# EAGLE design pebble (EAGLE 5.10)
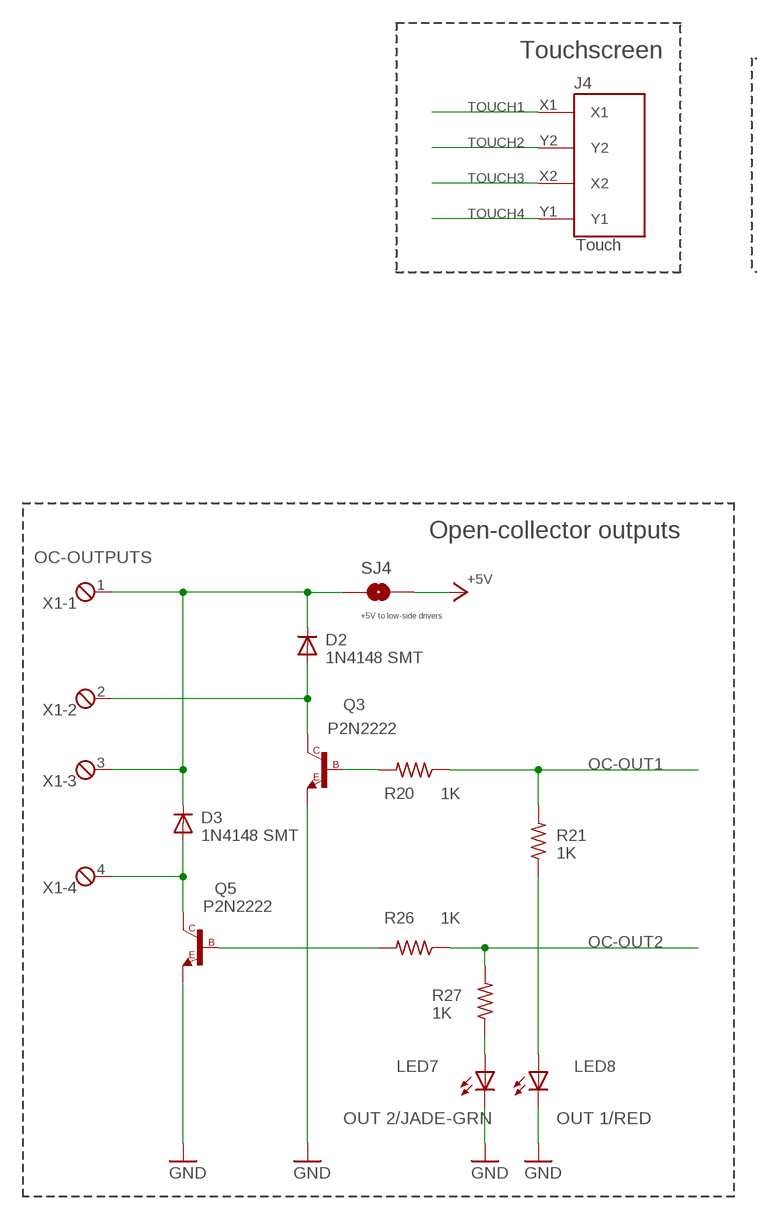
[diagram p0: schematic, sheet 1, part 1 of 2]
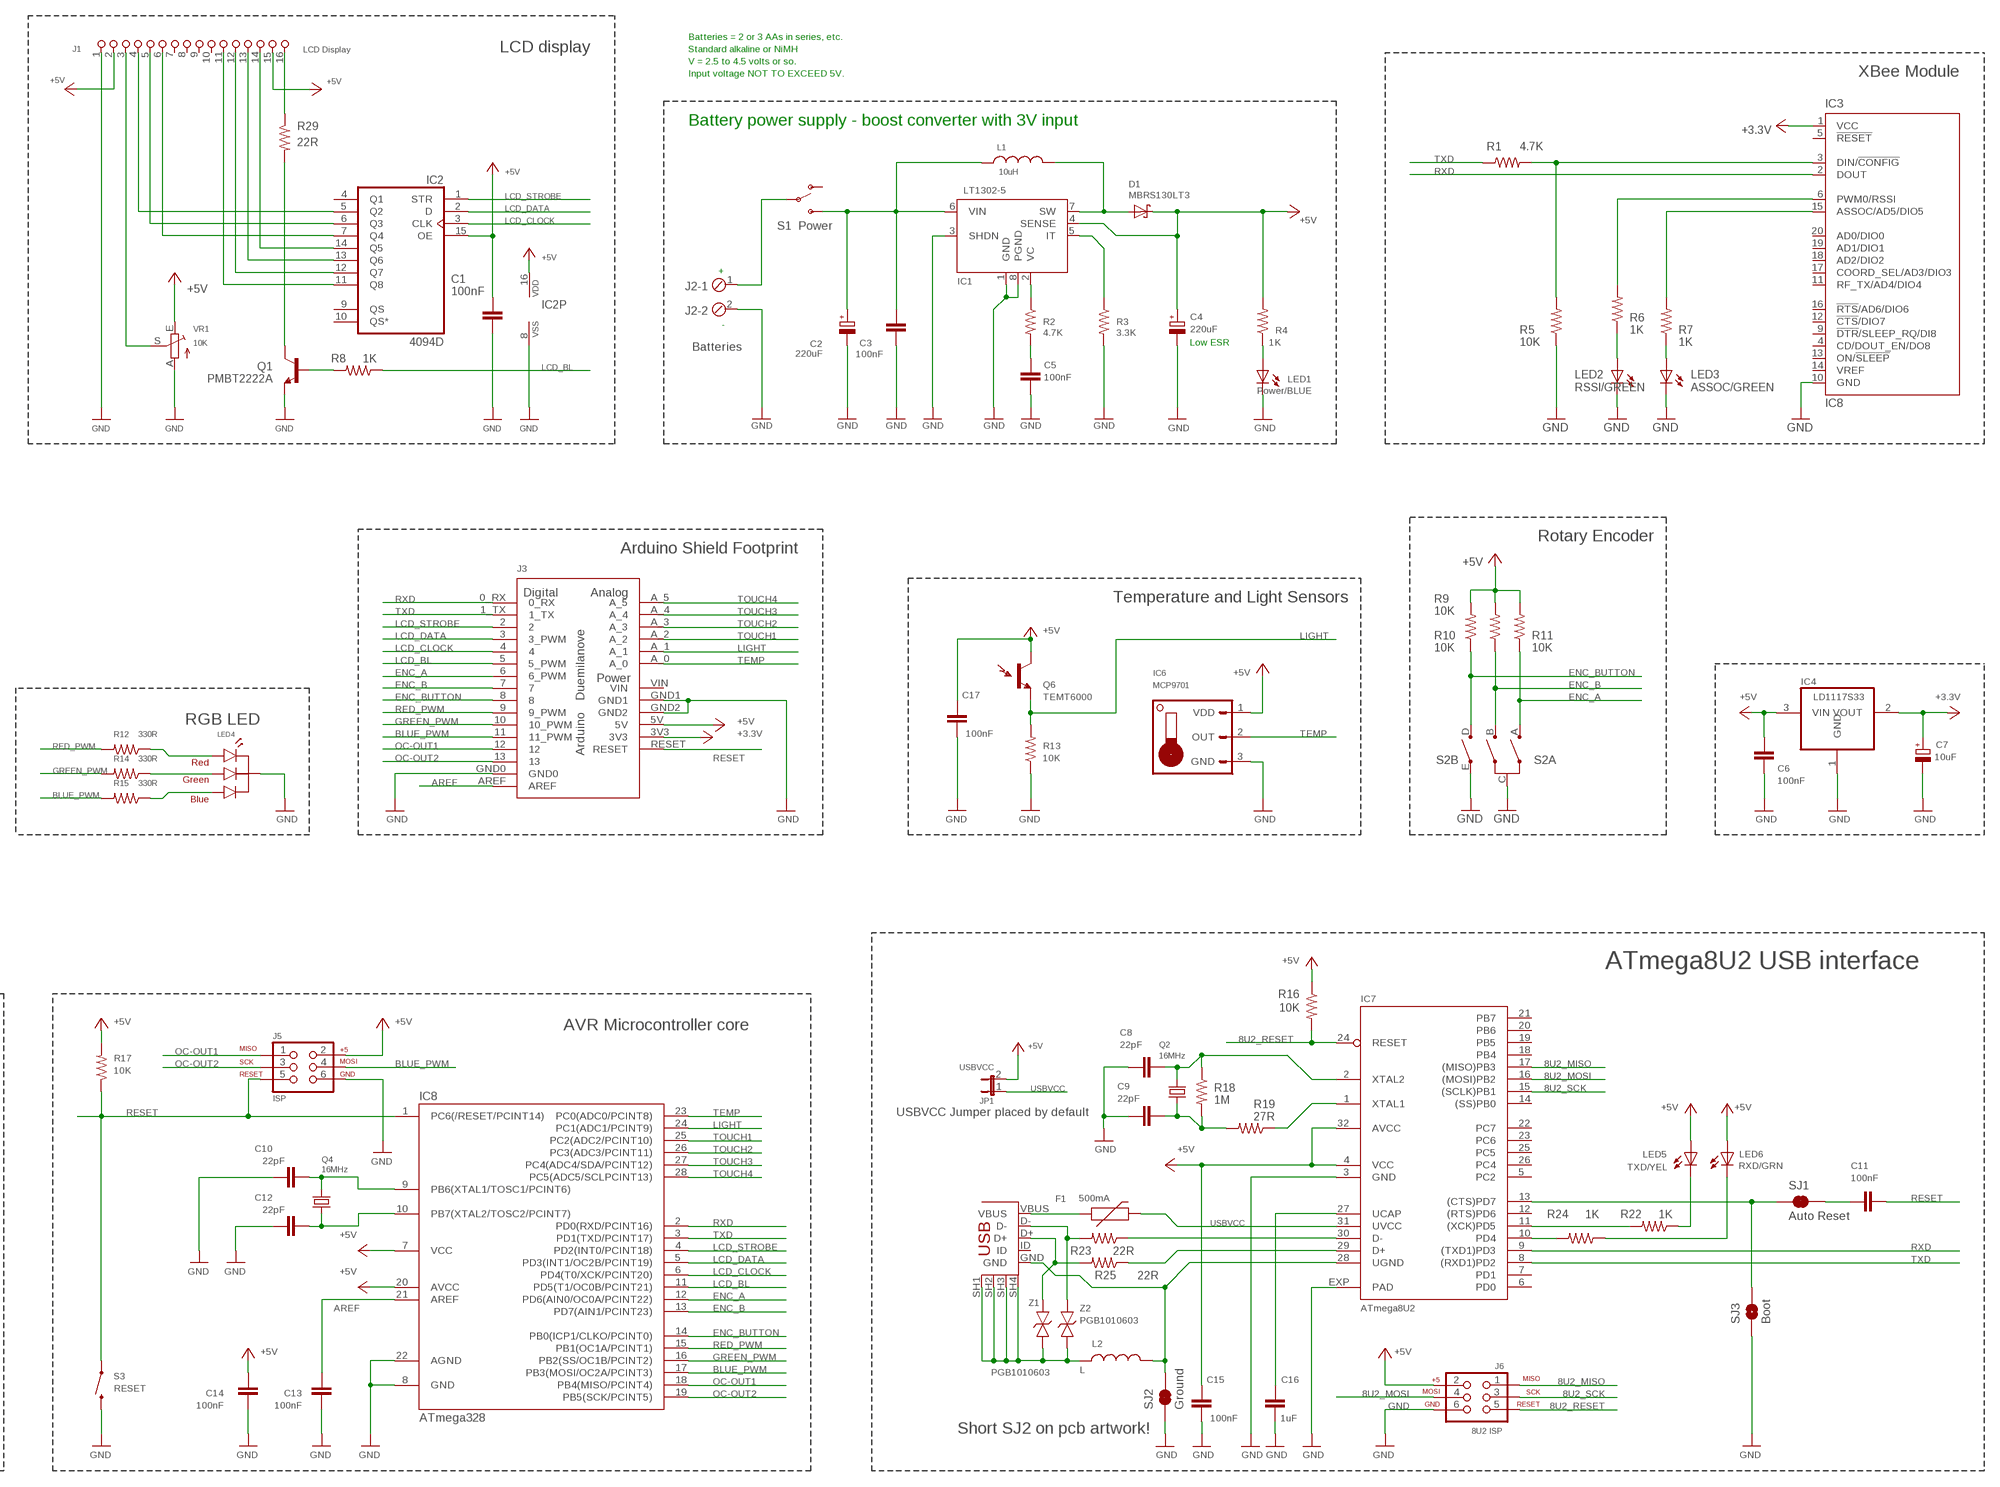
[diagram p1: schematic, sheet 1, part 2 of 2]

## Parts
C1  100nF  C-EUC0805K  [C0805K]
C2  220uF  CPOL-EUE2.5-6  [E2,5-6]
C3  100nF  CAP0805  [0805]
C4  220uF  CPOL-EUE2.5-6  [E2,5-6]
C5  100nF  CAP0805  [0805]
C6  100nF  CAP0805  [0805]
C7  10uF  CPOL-EUSMCC  [SMC_C]
C8  22pF  CAP0805  [0805]
C9  22pF  CAP0805  [0805]
C10  22pF  C-EUC0805  [C0805]
C11  100nF  CAP0805-LARGE  [0805-LARGE]
C12  22pF  C-EUC0805  [C0805]
C13  100nF  C-EUC0805K  [C0805K]
C14  100nF  C-EUC0805K  [C0805K]
C15  100nF  CAP0805-LARGE  [0805-LARGE]
C16  1uF  CAP0805-LARGE  [0805-LARGE]
C17  100nF  CAP0805-LARGE  [0805-LARGE]
D1  MBRS130LT3  SCHOTTKY-DIODESMD  [SMB]
D2  1N4148 SMT  DIODESOD  [SOD-323]
D3  1N4148 SMT  DIODESOD  [SOD-323]
F1  500mA  PTC1812  [1812]
IC1  LT1302-5  [SOIC8]
IC2  4094D  [SO16]
IC3  IC8  XBEE  [XBEE-PRO]
IC4  LD1117S33  REG1117  [SOT223]
IC6  MCP9701  MCP9700  [TO92-STRAIGHT]
IC7  ATmega8U2  ATMEL_ATMEGA8U2-MUQFN  [ATMEL_QFN32]
IC8  ATmega328  ATMEGA328-DIP  [DIP28-0.3]
J1  LCD Display  HEADER-16  [HEADER-16]
J2  Batteries  MPT2  [2POL254]
J3  Arduino Shield  ARDUINO-USBNO-OUTLINE-NO-TEXT-OCTAGONAL  [NO-OUTLINE-OCTAGONAL-NOTEXT]
J4  Touch  DS_TOUCH_CONNECTOR  [DS_TOUCH_CONNECTOR]
J5  ISP  [ISP]
J6  8U2 ISP  ISP  [ISP]
JP1  USBVCC  JP1E  [JP1]
L1  10uH  INDUCTOR-5.08  [INDUCTOR-5.08]
L2  L  INDUCTOR0805-LARGE  [0805-LARGE]
LED1  Power/BLUE  LEDCHIPLED_0805  [CHIPLED_0805]
LED2  RSSI/GREEN  LEDCHIPLED_0805  [CHIPLED_0805]
LED3  ASSOC/GREEN  LEDCHIPLED_0805  [CHIPLED_0805]
LED4  RGBLED_CC  [5MM_RGB_LED]
LED5  TXD/YEL  LEDCHIPLED_0805  [CHIPLED_0805]
LED6  RXD/GRN  LEDCHIPLED_0805  [CHIPLED_0805]
LED7  OUT 2/JADE-GRN  LEDCHIPLED_0805  [CHIPLED_0805]
LED8  OUT 1/RED  LEDCHIPLED_0805  [CHIPLED_0805]
P1  USB  USB-FT  [USB-MINIB-FT]
Q1  PMBT2222A  BC848SMD  [SOT23]
Q2  16MHz  CRYSTALHC49UV  [HC49U-V]
Q3  P2N2222  2N2222TO92  [TO92-STRAIGHT]
Q4  16MHz  CRYSTALHC49UV  [HC49U-V]
Q5  P2N2222  2N2222TO92  [TO92-STRAIGHT]
Q6  TEMT6000  [TEMT6000-SEN]
R1  4.7K  R-US_R0805  [R0805]
R2  4.7K  R-US_R0805  [R0805]
R3  3.3K  R-US_R0805  [R0805]
R4  1K  R-US_R0805  [R0805]
R5  10K  R-US_R0805  [R0805]
R6  1K  R-US_R0805  [R0805]
R7  1K  R-US_R0805  [R0805]
R8  1K  R-US_R0805  [R0805]
R9  10K  R-US_R0805  [R0805]
R10  10K  R-US_R0805  [R0805]
R11  10K  R-US_R0805  [R0805]
R12  330R  R-US_R0805  [R0805]
R13  10K  R-US_R0805  [R0805]
R14  330R  R-US_R0805  [R0805]
R15  330R  R-US_R0805  [R0805]
R16  10K  R-US_R0805  [R0805]
R17  10K  R-US_M0805  [M0805]
R18  1M  R-US_R0805  [R0805]
R19  27R  R-US_R0805  [R0805]
R20  1K  R-US_R0805  [R0805]
R21  1K  R-US_R0805  [R0805]
R22  1K  R-US_R0805  [R0805]
R23  22R  R-US_R0805  [R0805]
R24  1K  R-US_R0805  [R0805]
R25  22R  R-US_R0805  [R0805]
R26  1K  R-US_R0805  [R0805]
R27  1K  R-US_R0805  [R0805]
R29  22R  R-US_R0805  [R0805]
S1  Power  SWITCH-SPST-SMD-A  [SWITCH-SPST-SMD-A]
S2  CI-11  [CI-11]
S3  RESET  SWITCH-MOMENTARY-2SMD  [TACTILE_SWITCH_SMD]
SJ1  Auto Reset  SJ-NC  [SJ-NC]
SJ2  Ground  SJ-NC  [SJ-NC]
SJ3  Boot  SJ-NO  [SJ-NO]
SJ4  +5V to low-side drivers  SJ-NO  [SJ-NO]
VR1  10K  TRIM_EU-SP19L  [SP19L]
X1  OC-OUTPUTS  MPT4  [4POL254]
Z1  PGB1010603  TVS_0603  [FREETRONICS_0603]
Z2  PGB1010603  TVS_0603  [FREETRONICS_0603]

## Nets
8U2_MISO: IC7.17((MISO)PB3) J6.1
8U2_MOSI: IC7.16((MOSI)PB2) J6.4
8U2_RESET: IC7.24(RESET) J6.5 R16.2
8U2_SCK: IC7.15((SCLK)PB1) J6.3
+3V3: C7.+ IC3.1(VCC) IC4.2(VOUT) J3.3V3 ; supply symbol labelled +3.3V
+5V: C1.1 C4.+ C6.2 C14.1 C15.1 C17.1 D1.C IC1.4(SENSE) IC2.15(OE) IC2.16(VDD) IC4.3(VIN) IC6.1(VDD) IC7.4(VCC) IC7.32(AVCC) IC8.7(VCC) IC8.20(AVCC) J1.2 J1.15 J3.5V J5.2 J6.2 JP1.2 LED5.A LED6.A Q6.COLLECTOR(C1) R4.2 R9.2 R10.2 R11.2 R16.1 R17.2 SJ4.2 VR1.E
AREF: C13.1 IC8.21(AREF) J3.AREF
BLUE_PWM: IC8.17(PB3(MOSI/OC2A/PCINT3)) J3.11(11_PWM) J5.4 R15.2
ENC_A: IC8.12(PD6(AIN0/OC0A/PCINT22)) J3.6(6_PWM) R11.1 S2.A(A:A)
ENC_B: IC8.13(PD7(AIN1/PCINT23)) J3.7 R10.1 S2.B(A:B)
ENC_BUTTON: IC8.14(PB0(ICP1/CLKO/PCINT0)) J3.8 R9.1 S2.D(B:D)
GND: C1.2 C2.- C3.1 C4.- C5.1 C6.1 C7.- C8.1 C9.1 C10.1 C12.1 C13.2 C14.2 C15.2 C16.2 C17.2 IC1.1(GND) IC1.3(SHDN) IC1.8(PGND) IC2.8(VSS) IC3.10(GND) IC4.1(GND) IC6.3(GND) IC7.3(GND) IC7.EXP(PAD) IC8.8(GND) IC8.22(AGND) J1.1 J2.2 J3.GND0 J3.GND1 J3.GND2 J5.6 J6.6 LED1.C LED2.C LED3.C LED4.2 LED7.C LED8.C Q1.2(E) Q3.3(E) Q5.3(E) R3.2 R5.1 R13.1 S2.C(A:C) S2.E(B:E) S3.3 SJ2.1 SJ3.1 VR1.A
GREEN_PWM: IC8.16(PB2(SS/OC1B/PCINT2)) J3.10(10_PWM) R14.2
LCD_BL: IC8.11(PD5(T1/OC0B/PCINT21)) J3.5(5_PWM) R8.1
LCD_CLOCK: IC2.3(CLK) IC8.6(PD4(T0/XCK/PCINT20)) J3.4
LCD_DATA: IC2.2(D) IC8.5(PD3(INT1/OC2B/PCINT19)) J3.3(3_PWM)
LCD_STROBE: IC2.1(STR) IC8.4(PD2(INT0/PCINT18)) J3.2
LIGHT: IC8.24(PC1(ADC1/PCINT9)) J3.A_1 Q6.EMITTER(E1) R13.2
N$1: LED4.1 R12.1
N$2: LED4.4 R14.1
N$3: D2.2(A) Q3.1(C) X1.2
N$4: LED4.3 R15.1
N$5: D3.2(A) Q5.1(C) X1.4
N$6: LED7.A R27.1
N$7: IC2.5(Q2) J1.4
N$8: C2.+ C3.2 IC1.6(VIN) L1.1 S1.3(S)
N$9: IC2.6(Q3) J1.5
N$10: IC2.7(Q4) J1.6
N$11: Q5.2(B) R26.2
N$12: Q3.2(B) R20.2
N$13: LED8.A R21.1
N$14: IC2.11(Q8) J1.11
N$15: IC2.12(Q7) J1.12
N$16: IC2.13(Q6) J1.13
N$17: IC2.14(Q5) J1.14
N$18: IC1.2(VC) R2.1
N$19: Q1.1(B) R8.2
N$20: LED3.A R7.1
N$21: IC3.15(ASSOC/AD5/DIO5) R7.2
N$22: D1.A IC1.7(SW) L1.2
N$23: IC3.6(PWM0/RSSI) R6.2
N$24: LED2.A R6.1
N$25: Q1.3(C) R29.2
N$26: IC3.3(DIN/!CONFIG) R1.2 R5.2
N$27: C10.2 IC8.9(PB6(XTAL1/TOSC1/PCINT6)) Q4.2
N$28: C12.2 IC8.10(PB7(XTAL2/TOSC2/PCINT7)) Q4.1
N$29: IC1.5(IT) R3.1
N$30: C5.2 R2.2
N$31: LED1.A R4.1
N$32: J2.1 S1.2(P)
N$34: J1.16 R29.1
N$35: D2.1(C) D3.1(C) SJ4.1 X1.1 X1.3
N$36: C11.1 SJ1.2
N$94: C8.2 IC7.2(XTAL2) Q2.2 R18.1
N$95: IC7.1(XTAL1) R19.1
N$96: C9.2 Q2.1 R18.2 R19.2
N$97: F1.1 P1.VBUS
N$98: P1.D+ R25.2 Z1.1
N$100: C16.1 IC7.27(UCAP)
N$101: P1.D- R23.2 Z2.1
N$103: IC7.30(D-) R23.1
N$104: IC7.29(D+) R25.1
N$105: LED6.C R24.1
N$109: IC7.13((CTS)PD7) SJ1.1 SJ3.2
N$110: IC7.11((XCK)PD5) R22.2
N$111: IC7.10(PD4) R24.2
N$116: LED5.C R22.1
N$119: IC7.28(UGND) L2.2 P1.GND SJ2.2
N$120: L2.1 P1.SH1(SH$1) P1.SH2(SH$2) P1.SH3(SH$3) P1.SH4(SH$4) Z1.2 Z2.2
OC-OUT1: IC8.18(PB4(MISO/PCINT4)) J3.12 J5.1 R20.1 R21.2
OC-OUT2: IC8.19(PB5(SCK/PCINT5)) J3.13 J5.3 R26.1 R27.2
RED_PWM: IC8.15(PB1(OC1A/PCINT1)) J3.9(9_PWM) R12.2
RESET: C11.2 IC8.1(PC6(/RESET/PCINT14)) J3.RESET J5.5 R17.1 S3.1
RXD: IC3.2(DOUT) IC7.9((TXD1)PD3) IC8.2(PD0(RXD/PCINT16)) J3.0_RX
TEMP: IC6.2(OUT) IC8.23(PC0(ADC0/PCINT8)) J3.A_0
TOUCH1: IC8.25(PC2(ADC2/PCINT10)) J3.A_2 J4.X1
TOUCH2: IC8.26(PC3(ADC3/PCINT11)) J3.A_3 J4.Y2
TOUCH3: IC8.27(PC4(ADC4/SDA/PCINT12)) J3.A_4 J4.X2
TOUCH4: IC8.28(PC5(ADC5/SCLPCINT13)) J3.A_5 J4.Y1
TXD: IC7.8((RXD1)PD2) IC8.3(PD1(TXD/PCINT17)) J3.1_TX R1.1
USBVCC: F1.2 IC7.31(UVCC) JP1.1
VR1: J1.3 VR1.S
Unconnected: IC2.4(Q1) IC2.9(QS) IC2.10(QS*) IC3.4(CD/DOUT_EN/DO8) IC3.5(!RESET) IC3.9(!DTR!/SLEEP_RQ/DI8) IC3.11(RF_TX/AD4/DIO4) IC3.12(!CTS!/DIO7) IC3.13(ON/!SLEEP) IC3.14(VREF) IC3.16(!RTS!/AD6/DIO6) IC3.17(COORD_SEL/AD3/DIO3) IC3.18(AD2/DIO2) IC3.19(AD1/DIO1) IC3.20(AD0/DIO0) IC7.5(PC2) IC7.6(PD0) IC7.7(PD1) IC7.12((RTS)PD6) IC7.14((SS)PB0) IC7.18(PB4) IC7.19(PB5) IC7.20(PB6) IC7.21(PB7) IC7.22(PC7) IC7.23(PC6) IC7.25(PC5) IC7.26(PC4) J1.7 J1.8 J1.9 J1.10 P1.ID S1.1(O)

## Notes on the sheet
- Batteries = 2 or 3 AAs in series, etc.
- LCD display | Standard alkaline or NiMH
- V = 2.5 to 4.5 volts or so.
- Input voltage NOT TO EXCEED 5V. | XBee Module
- Battery power supply - boost converter with 3V input
- +
- -
- Low ESR
- Rotary Encoder
- Arduino Shield Footprint
- Temperature and Light Sensors
- Touchscreen
- RGB LED
- ATmega8U2 USB interface
- Open-collector outputs
- AVR Microcontroller core
- USBVCC Jumper placed by default
- Short SJ2 on pcb artwork!

## Power pins joined to a net without a drawn wire
VIN: J3.VIN

## Library data of the parts
C1 C10 C12 = rcl:C-EU: CAPACITOR, European symbol
C2 C4 C7 = rcl:CPOL-EU: POLARIZED CAPACITOR, European symbol
C3 C5 C6 C8 C9 C11 C15 C17 = freetronics-marc:CAP: Capacitor Standard 0603 ceramic capacitor, and 0.1" leaded capacitor.
C13 C14 = resistor:C-EU: CAPACITOR, European symbol
C16 = freetronics-master-v1:CAP: Capacitor Standard 0603 ceramic capacitor, and 0.1" leaded capacitor.
D1 = diode:SCHOTTKY-DIODE: Schottky Diode
D2 D3 = SparkFun:DIODE: Diode These are standard reverse protection diodes and small signal diodes. SMA package can handle up to about 1A. SOD-323 can handle about 200mA. What the SOD-323 package when ordering, there are some mfgs out there that are 5-pin packages.
F1 = EtherMega2:PTC1812
IC1 = Luke:LT1302-5
IC2 = 40xx:4094: 8-stage SHIFT/STORE REGISTER, tri-state
IC3 = Luke:XBEE
IC4 = burr-brown:REG1117: 800mA and 1A Low Dropout (LDO) Positive Regulator 1.8V, 2.5V, 2.85V, 3.3V, 5V, and Adj; MPN: REG1117; OC_FARNELL: 1097566; OC_NEWARK: 14P6981
IC6 = freetronics-master-v1:MCP9700
IC7 = freetronics-jon:ATMEL_ATMEGA8U2-MU
IC8 = Luke:ATMEGA328-DIP
J1 = Luke:HEADER-16
J2 = con-phoenix-254:MPT2: PHOENIX CONNECTOR; OC_FARNELL: unknown; OC_NEWARK: unknown
J3 = Arduino-Various:ARDUINO-USB: The Ardiuno Duemilanove Pinouts layoutet as a Bare Shield. v0.5 Also for Arduino Diecimila. This is designed as a Part and has no Outline in the Dimension Layer. The Outline, when present, is drawed at the tPlace / bPlace Layer. Library by Stephanie Lange, http://www.k-ita.de/~sl/
J4 = SparkFun:DS_TOUCH_CONNECTOR: 4-pin DS touch screen connector
J5 J6 = Luke:ISP
JP1 = jumper:JP1E: JUMPER
L1 = Luke:INDUCTOR-5.08
L2 = freetronics-master-v1:INDUCTOR: Inductors Basic Inductor/Choke - 0603 and 1206. Footprints are not proven and vary greatly between part numbers.
LED1-LED3 LED5-LED8 = led:LED: LED OSRAM: - CHIPLED LG R971, LG N971, LY N971, LG Q971, LY Q971, LO R971, LY R971 LH N974, LH R974 LS Q976, LO Q976, LY Q976 LO Q996 - Hyper CHIPLED LW Q18S LB Q993, LB Q99A, LB R99A - SideLED LS A670, LO A670, LY A670, LG A670, LP A670 LB A673, LV A673, LT A673, LW A673 LH A674 LY A675 LS A676, LA A676, LO A676, LY A676, LW A676 LS A679, LY A679, LG A679 - Hyper Micro SIDELED® LS Y876, LA Y876, LO Y876, LY Y876 LT Y87S - SmartLED LW L88C, LW L88S LB L89C, LB L89S, LG L890 LS L89K, LO L89K, LY L89K LS L896, LA L896, LO L896, LY L896 - TOPLED LS T670, LO T670, LY T670, LG T670, LP T670 LSG T670, LSP T670, LSY T670, LOP T670, LYG T670 LG T671, LOG T671, LSG T671 LB T673, LV T673, LT T673, LW T673 LH T674 LS T676, LA T676, LO T676, LY T676, LB T676, LH T676, LSB T676, LW T676 LB T67C, LV T67C, LT T67C, LS T67K, LO T67K, LY T67K, LW E67C LS E67B, LA E67B, LO E67B, LY E67B, LB E67C, LV E67C, LT E67C LW T67C LS T679, LY T679, LG T679 LS T770, LO T770, LY T770, LG T770, LP T770 LB T773, LV T773, LT T773, LW T773 LH T774 LS E675, LA E675, LY E675, LS T675 LS T776, LA T776, LO T776, LY T776, LB T776 LHGB T686 LT T68C, LB T68C - Hyper Mini TOPLED® LB M676 - Mini TOPLED Santana® LG M470 LS M47K, LO M47K, LY M47K Source: http://www.osram.convergy.de LUXEON: - LUMILED® LXK2-PW12-R00, LXK2-PW12-S00, LXK2-PW14-U00, LXK2-PW14-V00 LXK2-PM12-R00, LXK2-PM12-S00, LXK2-PM14-U00 LXK2-PE12-Q00, LXK2-PE12-R00, LXK2-PE12-S00, LXK2-PE14-T00, LXK2-PE14-U00 LXK2-PB12-K00, LXK2-PB12-L00, LXK2-PB12-M00, LXK2-PB14-N00, LXK2-PB14-P00, LXK2-PB14-Q00 LXK2-PR12-L00, LXK2-PR12-M00, LXK2-PR14-Q00, LXK2-PR14-R00 LXK2-PD12-Q00, LXK2-PD12-R00, LXK2-PD12-S00 LXK2-PH12-R00, LXK2-PH12-S00 LXK2-PL12-P00, LXK2-PL12-Q00, LXK2-PL12-R00 Source: www.luxeon.com KINGBRIGHT: KA-3528ASYC Source: www.kingbright.com
LED4 = Luke:RGBLED_CC
P1 = freetronics-master-v1:USB-FT
Q1 = transistor-npn:BC848*: NPN Transistor
Q2 Q4 = freetronics-master-v1:CRYSTAL: Crystals Various standard crystals. Proven footprints. Spark Fun Electronics SKU : COM-00534
Q3 Q5 = freetronics-master-v1:2N2222*: NPN Transistor
Q6 = SparkFun:TEMT6000: Ambient Light Sensor Simple light detection sensor. Output varies with light intensity input. Spark Fun Electronics SKU : COM-08348
R1-R27 R29 = rcl:R-US_: RESISTOR, American symbol
S1 = SparkFun:SWITCH-SPST: SPST Switch Simple slide switch. Spark Fun Electronics SKU : COM-00102
S2 = piher:CI-11: 11mm Incemental Encoder Source: www.piher.net .. 04-CI-11v04.pdf; OC_FARNELL: unknown; OC_NEWARK: unknown
S3 = SparkFun:SWITCH-MOMENTARY-2
SJ1 SJ2 = Luke:SJ-NC
SJ3 SJ4 = Luke:SJ-NO
VR1 = pot:TRIM_EU-: POTENTIOMETER
X1 = con-phoenix-254:MPT4: PHOENIX CONNECTOR; OC_FARNELL: unknown; OC_NEWARK: unknown
Z1 Z2 = EtherMega2:TVS_0603

## Board
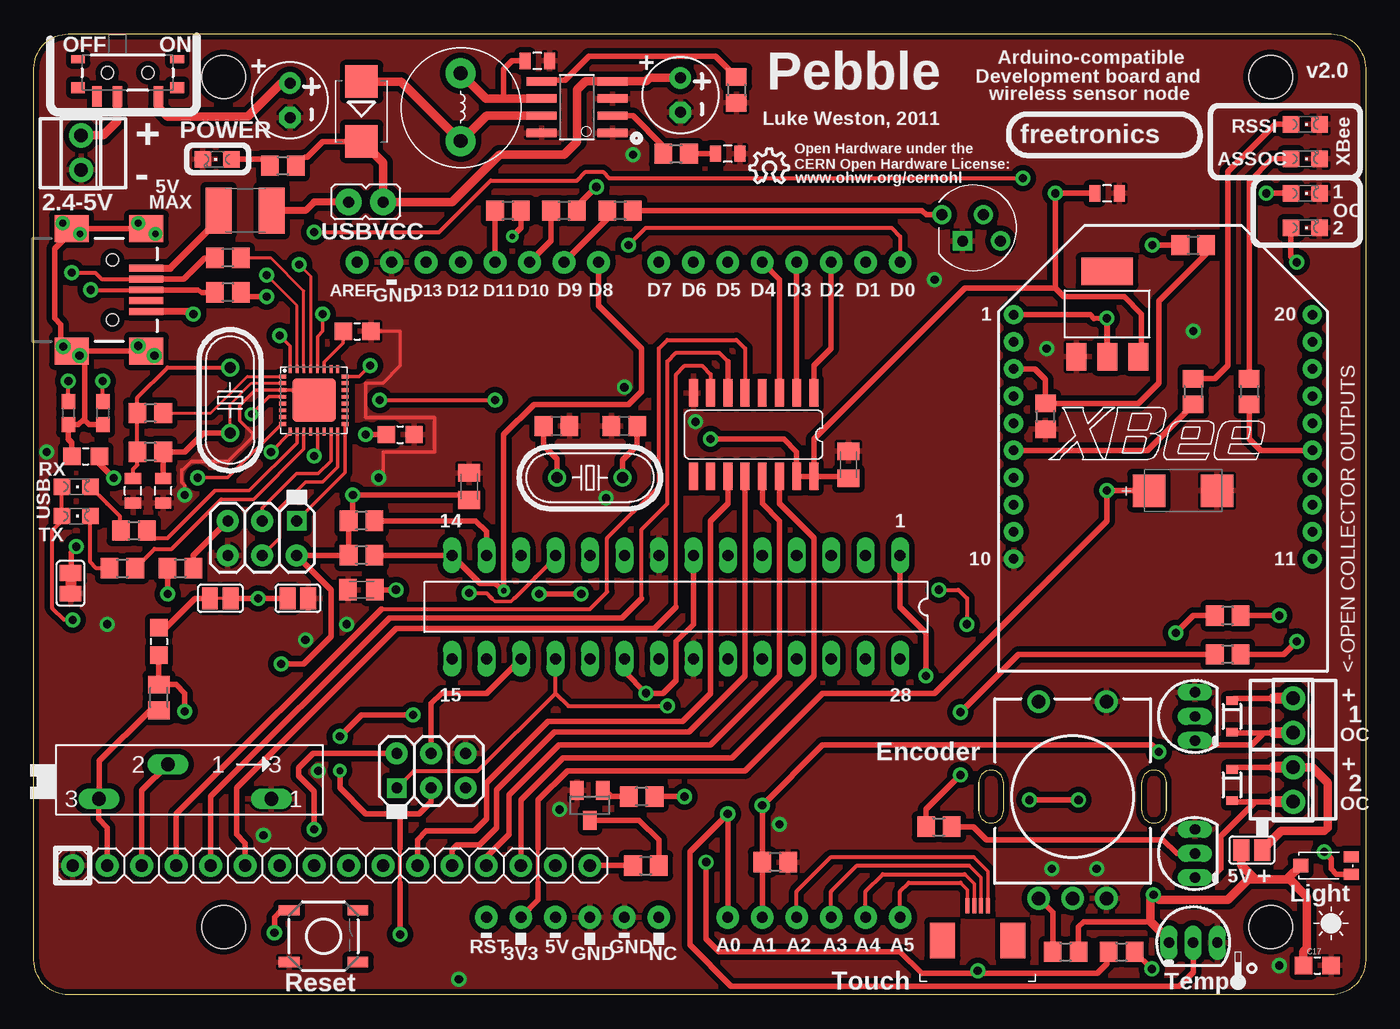
[diagram p2: board, top side]
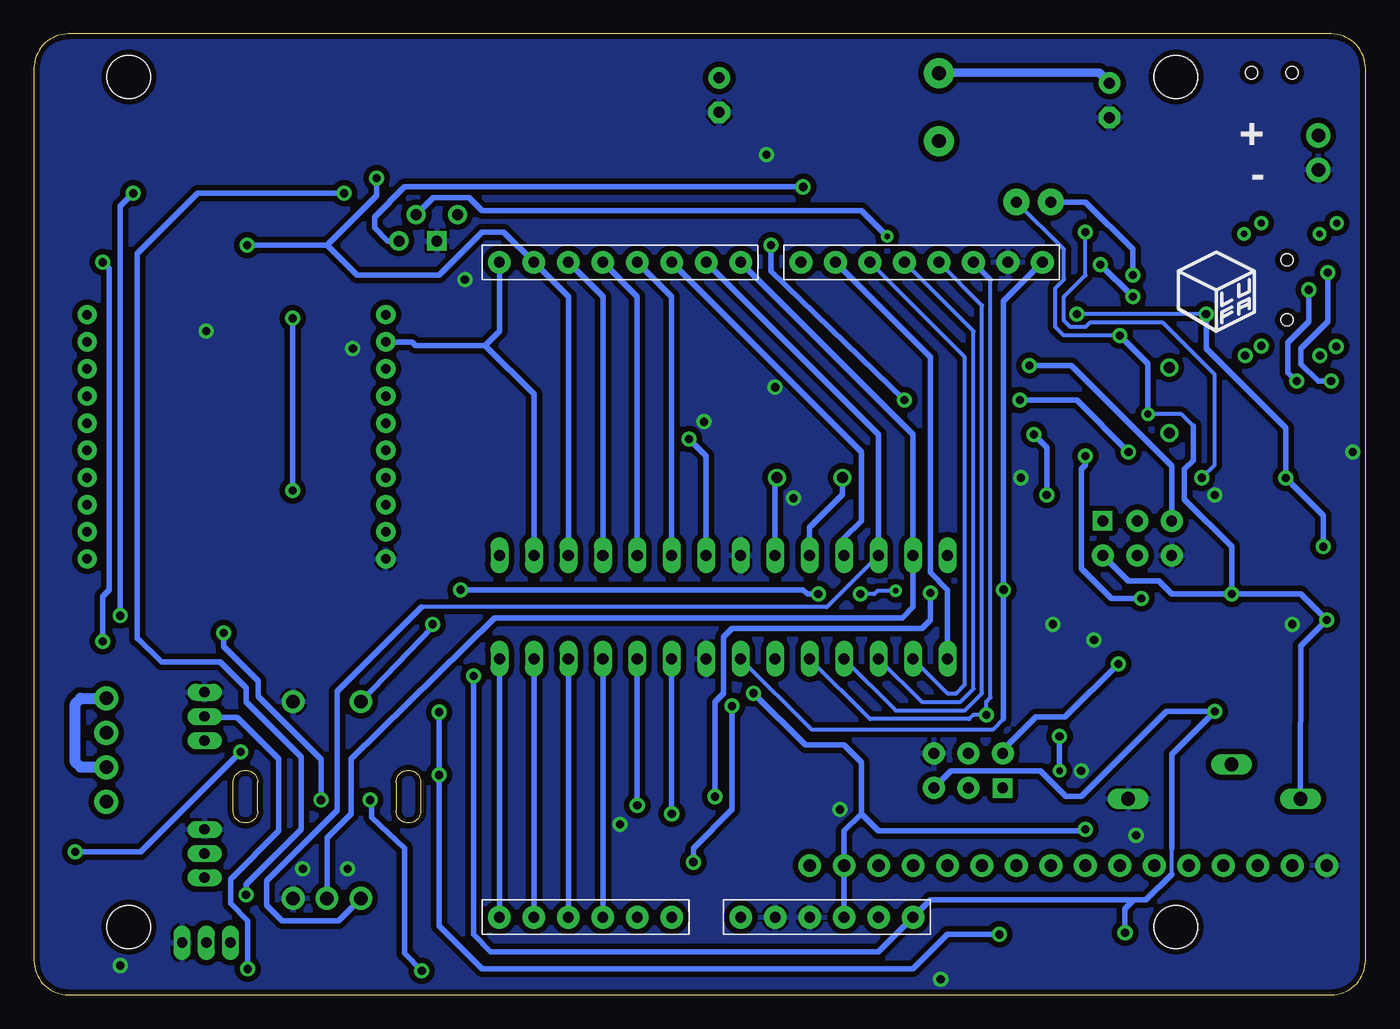
[diagram p3: board, bottom side, seen from below]

Size 98.11 x 70.8 mm. Coordinates in mm from the lower left corner, seen from the top.
Outline: 2.54,0 arc-90 0,2.54 0,68.26 arc-90 2.54,70.8 95.57,70.8 arc-90 98.11,68.26 98.11,2.54 arc-90 95.57,0 2.54,0
Copper layers (1*16): Top 0.035mm / dielectric 1.5mm / Bottom 0.035mm
Design rules "PCBCart-Standard *": minimum track width 8mil, minimum drill 0.4mm, track to track 8mil, track to pad 8mil, pad to pad 8mil, via to via 8mil, smd to smd 8mil, copper to edge 14mil, drill to drill 8mil, minimum pad ring 10mil, minimum via ring 10mil, stop-mask expansion 3mil, vias tented up to drill 25mil, thermal gap 8mil
Holes 3.2 mm at 13.97,5 91.12,67.63 13.97,67.63 91.12,5

### Footprints (pad centres in the part's own frame; a part is rotated, then mirrored left to right if it is on the bottom)
C0805K = smd 1.3 x 1.6: 1 -1,0; 2 1,0
E2,5-6 = drill 0.813 pad 1.6 round: + -1.27,0 | drill 0.813 pad 1.6 octagon: - 1.27,0
0805 = smd 0.8 x 1.2: 1 -0.9,0; 2 0.9,0
SMC_C = smd 2.4 x 2.4: + -2.5,0; - 2.5,0
C0805 = smd 1.3 x 1.5: 1 -0.95,0; 2 0.95,0
0805-LARGE = smd 1.27 x 1.27: 1 -1.016,0; 2 1.016,0
SMB = smd 2.4 x 2.4: A 2.2,0; C -2.2,0
SOD-323 = smd 0.63 x 0.83: 1 -1.15,0; 2 1.15,0
1812 = smd 1.9 x 3.4: 1 -1.95,0; 2 1.95,0
SOIC8 = smd 0.61 x 2.21: 1 -1.905,-2.616; 2 -0.635,-2.616; 3 0.635,-2.616; 4 1.905,-2.616; 5 1.905,2.616; 6 0.635,2.616; 7 -0.635,2.616; 8 -1.905,2.616
SO16 = smd 0.66 x 2.032: 1 -4.445,-3.073; 2 -3.175,-3.073; 3 -1.905,-3.073; 4 -0.635,-3.073; 5 0.635,-3.073; 6 1.905,-3.073; 7 3.175,-3.073; 8 4.445,-3.073; 9 4.445,3.073; 10 3.175,3.073; 11 1.905,3.073; 12 0.635,3.073; 13 -0.635,3.073; 14 -1.905,3.073; 15 -3.175,3.073; 16 -4.445,3.073
XBEE-PRO = drill 0.7 pad 1.422 round: 1 -11,10.27; 2 -11,8.27; 3 -11,6.27; 4 -11,4.27; 5 -11,2.27; 6 -11,0.27; 7 -11,-1.73; 8 -11,-3.73; 9 -11,-5.73; 10 -11,-7.73; 11 11,-7.73; 12 11,-5.73; 13 11,-3.73; 14 11,-1.73; 15 11,0.27; 16 11,2.27; 17 11,4.27; 18 11,6.27; 19 11,8.27; 20 11,10.27
SOT223 = smd 1.499 x 2.007: 1 -2.261,-3.15; 2 0.025,-3.15; 3 2.311,-3.15 | smd 3.81 x 2.007: 4 0,3.15
TO92-STRAIGHT = drill 0.762 pad 1.1 long: 1 -1.778,0; 2 0,0; 3 1.778,0
ATMEL_QFN32 = smd 0.6 x 0.3: 1 -2.3,1.75; 2 -2.3,1.25; 3 -2.3,0.75; 4 -2.3,0.25; 5 -2.3,-0.25; 6 -2.3,-0.75; 7 -2.3,-1.25; 8 -2.3,-1.75; 17 2.3,-1.75; 18 2.3,-1.25; 19 2.3,-0.75; 20 2.3,-0.25; 21 2.3,0.25; 22 2.3,0.75; 23 2.3,1.25; 24 2.3,1.75 | smd 0.3 x 0.6: 9 -1.75,-2.3; 10 -1.25,-2.3; 11 -0.75,-2.3; 12 -0.25,-2.3; 13 0.25,-2.3; 14 0.75,-2.3; 15 1.25,-2.3; 16 1.75,-2.3; 25 1.75,2.3; 26 1.25,2.3; 27 0.75,2.3; 28 0.25,2.3; 29 -0.25,2.3; 30 -0.75,2.3; 31 -1.25,2.3; 32 -1.75,2.3 | smd 3.2 x 3.2: EXP 0,0
DIP28-0.3 = drill 0.813 long: 1 -16.51,-3.81; 2 -13.97,-3.81; 3 -11.43,-3.81; 4 -8.89,-3.81; 5 -6.35,-3.81; 6 -3.81,-3.81; 7 -1.27,-3.81; 8 1.27,-3.81; 9 3.81,-3.81; 10 6.35,-3.81; 11 8.89,-3.81; 12 11.43,-3.81; 13 13.97,-3.81; 14 16.51,-3.81; 15 16.51,3.81; 16 13.97,3.81; 17 11.43,3.81; 18 8.89,3.81; 19 6.35,3.81; 20 3.81,3.81; 21 1.27,3.81; 22 -1.27,3.81; 23 -3.81,3.81; 24 -6.35,3.81; 25 -8.89,3.81; 26 -11.43,3.81; 27 -13.97,3.81; 28 -16.51,3.81
HEADER-16 = drill 0.9 pad 1.676 round: 1 -19.05,0; 2 -16.51,0; 3 -13.97,0; 4 -11.43,0; 5 -8.89,0; 6 -6.35,0; 7 -3.81,0; 8 -1.27,0; 9 1.27,0; 10 3.81,0; 11 6.35,0; 12 8.89,0; 13 11.43,0; 14 13.97,0; 15 16.51,0; 16 19.05,0
2POL254 = drill 1 pad 1.778 round: 1 -1.27,0; 2 1.27,0
NO-OUTLINE-OCTAGONAL-NOTEXT = drill 0.8 pad 1.676 round: 0_RX -25.4,27.94; 1_TX -25.4,25.4; 2 -25.4,22.86; 3 -25.4,20.32; 3V3 22.86,0; 4 -25.4,17.78; 5 -25.4,15.24; 5V 22.86,2.54; 6 -25.4,12.7; 7 -25.4,10.16; 8 -25.4,5.715; 9 -25.4,3.175; 10 -25.4,0.635; 11 -25.4,-1.905; 12 -25.4,-4.445; 13 -25.4,-6.985; A_0 22.86,15.24; A_1 22.86,17.78; A_2 22.86,20.32; A_3 22.86,22.86; A_4 22.86,25.4; A_5 22.86,27.94; AREF -25.4,-12.065; GND0 -25.4,-9.525; GND1 22.86,7.62; GND2 22.86,5.08; RESET 22.86,-2.54; VIN 22.86,10.16
DS_TOUCH_CONNECTOR = smd 1.85 x 2.6: P$5 -2.6,0.2; P$6 2.6,0.2 | smd 0.3 x 1.1: X1 0.75,2.75; X2 -0.25,2.75; Y1 -0.75,2.75; Y2 0.25,2.75
ISP = drill 0.8 pad 1.422 square: 1 -2.54,-1.27 | drill 0.8 pad 1.626 round: 2 -2.54,1.27; 3 0,-1.27; 4 0,1.27; 5 2.54,-1.27; 6 2.54,1.27
JP1 = drill 0.8 pad 1.93 round: 1 0,-1.27; 2 0,1.27
INDUCTOR-5.08 = drill 1 pad 2.184 round: 1 -2.5,0; 2 2.5,0
CHIPLED_0805 = smd 1.2 x 1.2: A 0,-1.05; C 0,1.05
5MM_RGB_LED = drill 0.8 pad 1.422 round: 1 -2.318,0.968; 3 0.73,0.968; 4 2,-0.968 | drill 0.8 pad 1.422 square: 2 -0.794,-0.968
USB-MINIB-FT = smd 2.5 x 0.5: D+ 2.5,0; D- 2.5,0.8; GND 2.5,-1.6; ID 2.5,-0.8; VBUS 2.5,1.6 | smd 2.5 x 2: SH1 -3,-4.5; SH2 -3,4.5; SH3 2.5,4.5; SH4 2.5,-4.5 | hole 0.9: 0,2.2; 0,-2.2
SOT23 = smd 1 x 1.4: 1 -0.95,-1.1; 2 0.95,-1.1; 3 0,1.1
HC49U-V = drill 0.813 round: 1 -2.413,0; 2 2.413,0
TEMT6000-SEN = smd 1.1 x 0.8: BASE -1.87,-0.65; EMITTER -1.87,0.65 | smd 1.1 x 1: COLLECTOR 1.86,0.01
R0805 = smd 1.3 x 1.5: 1 -0.95,0; 2 0.95,0
M0805 = smd 1.3 x 1.6: 1 -0.95,0; 2 0.95,0
SWITCH-SPST-SMD-A = smd 0.7 x 1.5: 1 -2.25,-1.75; 2 -0.75,-1.75; 3 2.25,-1.75 | smd 1 x 0.6: GND1 -3.65,1; GND3 3.65,1 | smd 1 x 0.8: GND2 -3.65,-1.1; GND4 3.65,-1.1 | hole 0.9: -1.5,0; 1.5,0
CI-11 = drill 1 pad 1.676 round: A -2.5,-7.5; B 0,-7.5; C 2.5,-7.5; D -2.5,7; E 2.5,7
TACTILE_SWITCH_SMD = smd 1.524 x 0.762: 1 -2.54,1.905; 2 2.54,1.905; 3 -2.54,-1.905; 4 2.54,-1.905
SJ-NC = smd 1.168 x 1.6: 1 -0.762,0; 2 0.762,0
SJ-NO = smd 1.168 x 1.6: 1 -0.762,0; 2 0.762,0
SP19L = drill 1.016 long: A 5.715,-1.27; E -6.985,-1.27; S -1.905,1.27
4POL254 = drill 1 pad 1.778 round: 1 -3.81,0; 2 -1.27,0; 3 1.27,0; 4 3.81,0
FREETRONICS_0603 = smd 1.1 x 1: 1 -0.85,0; 2 0.85,0

### Placement (x,y rotation side)
C1  60.01,39.05 90 top
C2  18.86,65.91 270 top
C3  37.08,68.82 180 top
C4  47.62,66.29 270 top
C5  51.12,61.98 180 top
C6  79.06,59.05 180 top
C7  84.65,37.15 0 top
C8  9.52,37.15 90 top
C9  7.3,37.15 90 top
C10  43.5,41.91 0 top
C11  9.21,26.04 270 top
C12  38.5,41.91 180 top
C13  24.13,29.84 180 top
C14  32.07,37.47 90 top
C15  26.99,41.27 0 top
C16  23.81,48.9 0 top
C17  94.55,2.16 0 top
D1  24.13,65.09 90 top
D2  88.27,20.51 270 top
D3  88.27,15.46 270 top
F1  15.56,57.79 0 top
IC1  40.01,65.41 90 top
IC2  53.02,41.27 180 top
IC3  83.19,39.85 0 top
IC4  79.06,50.16 0 top
IC6  85.41,3.84 0 top
IC7  20.64,43.82 0 top
IC8  47.31,28.57 180 top
J1  21.91,9.53 0 top
J2  3.48,62.06 270 top
J3  35.88,28.57 270 top
J4  69.53,3.81 0 top
J5  29.27,16.51 0 top
J6  16.83,33.66 180 top
JP1  24.45,58.42 270 top
L1  31.43,65.41 270 top
L2  3.81,39.69 0 top
LED1  13.49,61.56 90 top
LED2  93.66,64.13 270 top
LED3  93.66,61.59 270 top
LED4  69.22,56.52 0 top
LED5  3.11,35.27 270 top
LED6  3.11,37.43 270 top
LED7  93.66,56.52 270 top
LED8  93.66,59.05 270 top
P1  5.78,51.94 0 top
Q1  40.96,13.97 180 top
Q2  14.45,43.82 270 top
Q3  85.53,20.51 90 top
Q4  40.96,38.1 0 top
Q5  85.53,10.41 90 top
Q6  95.19,9.53 180 top
R1  85.41,55.25 0 top
R2  47.31,61.98 0 top
R3  51.75,66.67 270 top
R4  18.34,61.09 0 top
R5  74.53,42.62 90 top
R6  85.41,44.45 270 top
R7  89.53,44.45 270 top
R8  44.77,14.61 180 top
R9  24.13,32.39 180 top
R10  24.13,34.93 180 top
R11  76.01,3.17 0 top
R12  43.18,57.79 180 top
R13  54.61,9.78 180 top
R14  39.05,57.79 180 top
R15  34.92,57.79 180 top
R16  10.79,31.43 0 top
R17  9.21,21.91 270 top
R18  8.57,40.01 180 top
R19  8.57,42.86 180 top
R20  80.14,3.17 0 top
R21  87.95,27.94 180 top
R22  6.51,31.43 0 top
R23  14.29,54.29 180 top
R24  7.37,34.21 0 top
R25  14.29,51.75 180 top
R26  66.67,12.38 0 top
R27  87.95,25.08 180 top
R29  45.09,9.53 0 top
S1  6.91,67.94 0 top
S2  76.52,14.61 0 top
S3  21.34,4.32 0 top
SJ1  13.73,29.21 180 top
SJ2  2.7,30.32 90 top
SJ3  19.45,29.21 180 top
SJ4  89.73,10.67 180 top
U$1  [OSHW_8X100_NOTEXT]  52.77,59.82 0 top
VR1  11.78,15.72 0 top
X1  92.77,18.03 270 top
Z1  5.08,42.86 270 top
Z2  2.54,42.86 270 top

### Tracks (layer width: path | path; a pad name or v marks a point on that pad's centre or on a via)
8U2_MISO
  Top 0.254: IC7.17 22.94,38.5 J6.1
8U2_MOSI
  Top 0.254: IC7.16 22.39,38.9 21.27,37.78 20,37.78 18.1,35.88 18.1,33.66 J6.4
8U2_RESET  (via drill 0.6)
  Top 0.254: IC7.24 23.97,45.57 v24.76,46.36
  Top 0.305: R16.2
  Top 0.406: R16.2 11.75,32.39 J6.5
  Bottom 0.406: v24.76,46.36 21.67,46.36 14.29,38.97 J6.5
8U2_SCK
  Top 0.254: IC7.15 21.89,39.35 20.95,38.42 19.37,38.42 16.83,35.88 J6.3
+3V3  (via drill 0.6)
  Top 0.305: 37.15,8.26 37.15,10.79
  Top 0.406: IC4.2 79.08,49.82 v79.06,49.85 | v79.06,49.85 78.11,49.84 77.84,50.12 IC3.1 | v79.06,49.85 79.06,47.62 | C7.+ v79.06,37.15 79.06,34.93 66.36,22.22 58.1,22.22 52.39,16.51 39.31,16.51 37.15,14.35 37.15,10.79 | J3.3V3 37.15,6.99 37.15,8.26
  Bottom 0.406: v79.06,37.15 v79.06,49.85
+5V  (via drill 0.5, 0.6)
  Top 0.254: IC7.32 18.89,47.79 v18.1,48.58 | IC7.4 17.32,44.07 v16.03,42.78
  Top 0.305: v2.86,27.62 2.22,27.62 1.37,28.48 1.37,34.23 2,34.86 LED5.A | v9.84,29.53 | 32.07,36.83 C14.1 | LED5.A 2.16,34.86 | LED5.A LED6.A
  Top 0.406: IC2.16 IC2.15 56.2,40.01 55.24,40.96 v49.85,40.96 | IC4.3 81.37,47.4 81.6,47.62 81.6,50.16 80.33,51.44 75.88,51.44 75.25,52.07 | R9.2 R10.2 23.5,34.93 v23.5,36.83 32.07,36.83 | v18.22,24.38 19.88,24.38 21.91,26.42 21.91,29.84 J6.2 R9.2 | R11.2 76.96,5.01 77.34,5.4 82.3,5.4 82.23,5.46 | R9.2 | 75.25,52.07 v75.25,59.05 C6.2 | IC2.16 57.47,40.96 68.58,52.07 75.25,52.07 | IC2.16 59.86,38.2 C1.1 | v9.84,29.53 R16.1 | v24.45,41.27 C15.1 | 24.15,62.87 D1.C 24.11,62.87 21.27,62.87 20.13,61.73 19.97,61.73 19.79,61.59 R4.2 | J5.2 20.56,17.78 19.49,16.72 19.49,16.13 20.64,14.99 v20.64,12.19 | IC8.7 48.58,27.3 47.31,26.04 47.31,23.18 46.35,22.22 v45.09,22.22 43.5,23.81 IC8.20 | R17.2 8.57,20.95 4.79,17.24 VR1.E 4.76,14.41 4.76,12.95 5.4,12.32 J1.2
  Top 0.61: 82.23,5.46 82.23,7.11 v82.49,7.37 82.87,6.99 87.95,6.99 89.47,8.51 89.98,8.51 | C4.+ 45.34,67.56 45.09,67.31 IC1.4 40.64,67.31 40.01,66.67 40.01,62.87 39.05,61.91 34.29,61.91 30.8,58.42 JP1.2 25.72,61.3 D1.C | IC6.1 83.63,4.06 82.3,5.4 | 92.42,8.61 92.32,8.51 89.98,8.51 | 92.42,8.61 Q6.COLLECTOR | 89.98,8.51 88.96,9.53 SJ4.2 | C17.1 93.54,3.17 93.79,3.43 93.79,7.24 92.42,8.61
  Bottom 0.254: v9.84,29.53
  Bottom 0.305: v18.1,48.58 22.22,48.58 22.86,49.21 22.86,52.07 22.22,52.71 22.22,54.93 JP1.2 | v16.03,42.78 13.57,42.78 12.7,41.91
  Bottom 0.406: 37.15,13.34 38.42,12.06 J1.15 J3.5V | v18.22,24.38 22.16,20.47 22.16,20.48 24.29,20.48 26.73,18.03 J5.2 | v75.25,59.05 86.04,59.05 90.49,54.61 90.49,26.26 90.46,26.26 88.71,24.51 84.39,24.51 82.49,22.61 82.49,21.59 78.42,17.53 78.42,12.19 82.49,8.13 v82.49,7.37 | v45.09,22.22 41.27,18.41 38.42,18.41 37.15,17.14 37.15,13.34 | 37.15,13.34 35.88,12.06 20.76,12.06 v20.64,12.19 | v9.84,29.53 4.77,29.53 v2.86,27.62 4.78,25.7 VR1.E | v16.03,42.78 16.03,46.51 v18.1,48.58 | v23.5,36.83 23.5,40.32 v24.45,41.27 | 12.7,41.91 12.7,39.37 13.33,38.73 13.33,36.51 9.84,33.02 v9.84,29.53 14.29,29.53 15.24,30.48 17.46,30.48 J6.2 | IC8.7 48.58,39.21 48.58,39.69 | 48.58,39.69 48.58,39.37 | 48.58,39.69 v49.85,40.96 | v49.85,40.96
AREF  (via drill 0.6)
  Top 0.406: v26.67,29.84 C13.1
  Bottom 0.305: 40.8,19.53 27.46,19.53 26.67,20.32 | 40.8,19.53 | 40.8,19.53 IC8.21
  Bottom 0.406: 26.67,20.32 v26.67,29.84 26.67,51.12 J3.AREF
BLUE_PWM
  Top 0.406: R15.2 J3.11 | J5.4 29.27,21.46 30.04,22.22 31.18,22.22 33.34,22.22 IC8.17
  Bottom 0.305: J3.11 28.89,48.9 28.89,22.54 29.84,21.59 32.7,21.59 IC8.17
ENC_A
  Top 0.406: R11.1 75.06,6.06 S2.A
  Bottom 0.305: 69.53,28.57 39.69,28.57 IC8.12
  Bottom 0.406: J3.6 35.88,41.27 IC8.12 | 69.53,28.57 75.76,22.35 75.76,13.59 80.96,8.38 80.96,6.6 79.82,5.46 75.66,5.46 S2.A
ENC_B
  Top 0.406: R10.1 32.54,34.93 33.34,34.13 IC8.13
  Bottom 0.406: J3.7 33.34,41.27 IC8.13 33.34,28.57 34.13,27.78 64.17,27.78 74.74,17.4 74.74,13.34 76.52,11.56 S2.B
ENC_BUTTON  (via drill 0.4, 0.6)
  Top 0.305: v66.67,29.84 68.1,29.84 68.74,29.21 v68.74,27.3 | v68.74,27.3
  Top 0.406: v37.23,29.53 v40.32,29.53 | J3.8 41.59,50.8 44.77,47.62 44.77,44.45 43.81,43.5 36.83,43.5 34.61,41.27 v34.61,29.77 33.97,30.32 32.86,30.32 IC8.14 | IC8.14 | R9.1 IC8.14
  Bottom 0.305: v34.61,29.77 35.96,29.77 36.2,29.53 v37.23,29.53
  Bottom 0.406: S2.D 68.76,27.07 v68.74,27.3 | v40.32,29.53 41.12,29.53 41.43,29.84 v66.67,29.84
GND  (via drill 0.6, 0.6 pad 0.61)
  Top 0.254: 19.89,44.57 IC7.3 16.31,44.57 15.16,43.42 15.16,42.31 16.11,41.35 16.11,41.12 14.29,39.29 11.59,39.29 10.95,38.66 10.87,38.66 10.87,37.78 11.11,37.54 v11.11,36.83 | C16.2 26.99,48.9 26.99,46.36 25.72,45.09 24.45,45.09 24.45,42.55 29.53,42.55 29.53,40.01 25.72,40.01 25.72,38.42 v25.4,38.1
  Top 0.305: 19.89,44.57 IC7.EXP
  Top 0.406: SJ2.1 2.73,29.59
  Top 0.813: 2.73,29.59 2.73,31.11
  other vias: 74.61,47.62 48.74,42.23 54.93,12.57 38.73,13.65 23.05,27.3 42.15,36.59 43.5,44.77 16.91,11.75 66.36,52.71 20,26.16 85.41,48.9 5.4,27.3 44.13,61.91 20.95,16.51 78.3,9.27 74.99,9.27 91.76,2.16 31.31,1.14 0.95,40.01
  pour Top (isolate 0.406): 0.06,68.2 0.06,68.45 arc-90 2.48,70.87 95.44,70.87 arc-90 98.11,68.2 98.11,2.54 arc-90 95.57,0 2.48,0 arc-90 0.06,2.41
  pour Bottom (isolate 0.406): 0.06,68.2 0.06,68.45 arc-90 2.48,70.87 95.44,70.87 arc-90 98.11,68.2 98.11,2.54 arc-90 95.57,0 2.48,0 arc-90 0.06,2.41
GREEN_PWM
  Top 0.406: R14.2 38.1,55.57 J3.10
  Bottom 0.305: J3.10 29.53,46.99 29.53,22.86 30.16,22.22 30.8,22.22 IC8.16
LCD_BL  (via drill 0.6, 0.6 pad 0.61)
  Top 0.254: 33.73,29.21 33.97,28.97 35.16,28.97 36.91,30.72
  Top 0.305: v32.07,29.61 33.34,29.61 33.66,29.29 33.73,29.21 | 36.91,30.72 | 36.91,30.72 36.99,30.8 | 36.99,30.8 38.02,31.83 38.02,31.99 IC8.11 | 36.99,30.8 35.4,29.21 | 36.99,30.8
  Top 0.406: v47.94,14.61 R8.1
  Bottom 0.406: J3.5 37.15,40.01 37.15,34.93 38.42,33.66 IC8.11 | v47.94,14.61 47.94,21.59 47.31,22.22 47.31,26.35 46.67,26.99 32.7,26.99 32.07,27.62 v32.07,29.61
LCD_CLOCK
  Top 0.406: IC2.3 54.93,52.71 J3.4
  Bottom 0.406: J3.4 51.12,51.44 IC8.6
LCD_DATA
  Top 0.406: J3.3 IC2.2
  Bottom 0.406: J3.3 53.66,51.44 IC8.5
LCD_STROBE
  Top 0.406: IC2.1 57.47,46.36 58.74,47.62 J3.2
  Bottom 0.406: J3.2 56.2,51.44 IC8.4
LIGHT  (via drill 0.6)
  Top 0.406: J3.A_1 53.66,9.53 | Q6.EMITTER 95.96,8.88 95.57,9.27 95.57,10.03 v95.06,10.54 | v82.87,17.91 82.36,18.41 58.1,18.41 v53.66,13.97 53.66,9.53 | 53.66,9.53 R13.2
  Bottom 0.406: v53.66,13.97 IC8.24 | v95.06,10.54 90.23,10.54 v82.87,17.91
N$1
  Top 0.406: LED4.1 65.74,57.48 65.44,57.79 R12.1
N$2  (via drill 0.6)
  Top 0.406: R14.1 40,58.1 v41.43,59.53
  Bottom 0.406: v41.43,59.53 70.49,59.53 70.8,59.53 73.03,57.31 73.03,56.52 72.06,55.55 LED4.4
N$3
  Top 0.406: D2.2 88.32,19.3 90.49,19.3 | 90.49,19.3 X1.2 | Q3.1 85.85,18.41 89.73,18.41 90.49,19.18 90.49,19.3
  Top 0.813: X1.2 91.38,19.3
N$4  (via drill 0.4)
  Top 0.406: R15.1 35.88,56.51 v35.24,55.88
  Bottom 0.406: v35.24,55.88 37.15,57.79 65.09,57.79 66.04,58.74 68.69,58.74 LED4.3
N$5
  Top 0.406: D3.2 88.35,14.22 89.98,14.22 | 89.98,14.22 X1.4 | Q5.1 86.8,8.64 87.44,9.27 87.44,11.68 89.98,14.22
  Top 0.813: X1.4 91.38,14.22
N$6  (via drill 0.6 pad 0.61)
  Top 0.406: v93.03,26.04 92.08,25.08 R27.1 89.22,24.76 | LED7.A 92.61,54.39 v93.03,53.98
  Bottom 0.406: v93.03,26.04 93.03,29.37 92.55,29.84 92.55,53.5 v93.03,53.98
N$7
  Top 0.305: IC2.5 52.39,47.62 51.75,48.26 46.67,48.26 46.04,47.62 46.04,37.47 42.23,33.66 42.23,29.69 40.96,28.42 25.61,28.42
  Top 0.406: 25.61,28.42 10.48,13.34 J1.4
N$8
  Top 0.406: C3.2 35.22,68.82 34.61,68.2 34.61,66.04
  Top 0.61: IC1.6 34.61,66.04 33.3,66.04 L1.1 | C2.+ 18.22,67.18 15.75,64.71 9.87,64.71 9.16,65.42 S1.3
  Bottom 0.61: C2.+ 19.62,67.94 30.8,67.94 | 30.8,67.94 31.08,67.94 | L1.1 30.84,67.91 30.8,67.94
N$9
  Top 0.305: 51.12,46.67 50.48,47.31 47.31,47.31 46.67,46.67 46.67,36.2 44.77,34.29 44.77,29.21
  Top 0.406: 51.12,46.67 IC2.6 | 44.77,29.21 43.34,27.78 26.19,27.78 13.02,14.61 J1.5
N$10
  Top 0.305: IC2.7 49.85,45.72 49.21,46.36 47.94,46.36 47.31,45.72 47.31,28.57
  Top 0.406: 47.31,28.57 45.72,26.99 26.67,26.99 14.92,15.24 14.92,11.81 15.56,11.18 J1.6
N$11
  Top 0.406: R26.2 69.22,12.38 70.17,11.43 83.19,11.43 84.2,10.41 Q5.2
N$12  (via drill 0.6)
  Top 0.406: R20.2 v82.36,1.91
  Bottom 0.406: v82.36,1.91 82.36,5.46 83.63,6.73 83.63,8.51 80.07,12.06 80.07,17.4 83.12,20.45 85.47,20.45 Q3.2
N$13  (via drill 0.6 pad 0.61)
  Top 0.406: R21.1 v91.76,27.94 | v90.8,59.05 LED8.A
  Bottom 0.406: v91.76,27.94 91.76,58.1 v90.8,59.05
N$14
  Top 0.406: IC2.11 51.12,36.2 49.85,34.93 49.85,22.22 47.78,20.16 37.88,20.16 33.34,15.62 33.34,12.95 32.45,12.06 28.89,12.06 28.26,11.43 J1.11
N$15
  Top 0.406: IC2.12 52.39,23.49 48.26,19.37 38.35,19.37 34.1,15.11 34.1,12.32 32.83,11.05 31.18,11.05 30.8,10.67 J1.12
N$16
  Top 0.406: IC2.13 53.66,36.2 54.93,34.93 54.93,23.49 49.85,18.41 38.67,18.41 34.99,14.73 34.99,11.81 33.34,10.16 J1.13
N$17
  Top 0.406: IC2.14 54.93,36.2 57.47,33.66 57.47,23.49 51.44,17.46 38.99,17.46 35.88,14.35 J1.14
N$18
  Top 0.406: IC1.2 44.13,64.77 46.35,62.55 46.35,62.23 R2.1
N$19
  Top 0.406: Q1.1 42.08,15.07 42.55,14.61 R8.2
N$20
  Top 0.406: 92.61,61.82 LED3.A 91.2,61.59 89.53,59.93 R7.1
N$21
  Top 0.406: R7.2 89.53,40.96 89.62,40.88 89.85,40.64 90.38,40.12 IC3.15
N$22
  Top 0.61: IC1.7 33.34,64.77 31.47,62.91 L1.2 27.05,67.29 D1.A
N$23
  Top 0.406: IC3.6 82.02,40.12 R6.2
N$24
  Top 0.406: 92.39,64.13 LED2.A 91.44,64.13 87.95,60.64 87.95,46.36 86.99,45.4 R6.1
N$25
  Top 0.406: Q1.3 44.6,12.87 46.04,11.43 R29.2
N$26
  Top 0.406: R1.2 86.36,54.61 82.87,51.12 82.87,45.09 81.36,43.58 75.88,43.58 R5.2 74.53,45.32 73.74,46.12 IC3.3
N$27
  Top 0.406: C10.2 44.45,40.48 43.37,39.4 Q4.2
  Bottom 0.406: IC8.9 43.5,37.97 Q4.2
N$28
  Top 0.406: C12.2 37.54,40.48 38.54,39.48 Q4.1
  Bottom 0.406: Q4.1 38.54,36.86 40.96,34.45 IC8.10
N$29
  Top 0.406: IC1.5 37.47,67.39 39.13,67.39 40.89,69.15 50.23,69.15 R3.1
N$30
  Top 0.406: R2.2 C5.2
N$31
  Top 0.406: R4.1 16.93,61.56 LED1.A
N$32
  Top 0.61: J2.1 5.09,63.33 6.15,64.39 S1.2
N$34
  Top 0.406: J1.16 R29.1
N$35
  Top 0.406: D2.1 88.45,21.84 X1.1 | D3.1 88.42,16.76 X1.3
  Top 0.61: SJ4.1 91.88,12.06 95.06,12.06 95.31,12.32 95.31,15.62 94.17,16.76 X1.3
  Top 0.813: X1.1 91.38,21.84 | X1.3 91.38,16.76
  Bottom 0.813: X1.1 94.68,21.84 95.06,21.46 95.06,17.14 94.68,16.76 X1.3
N$36
  Top 0.406: C11.1 9.72,27.05 11.87,29.21 SJ1.2
N$94
  Top 0.203: IC7.2 16.01,45.07 14.45,43.5 Q2.2
  Top 0.305: R18.1
  Top 0.406: R18.1 11.11,40.01 12.51,41.4 Q2.2 | C8.2 R18.1
N$95
  Top 0.203: R19.1 13.02,42.86 15.72,45.57 IC7.1
N$96
  Top 0.305: C9.2 7.3,38.73 7.62,39.05 R18.2 R19.2 7.62,44.01 9.84,46.23 Q2.1
N$97
  Top 0.508: P1.VBUS 10.05,53.54 13.61,57.11 F1.1
N$98  (via drill 0.6)
  Top 0.305: Z1.1 v5.08,45.21 | v4.19,51.94 P1.D+
  Top 0.406: P1.D+ 12.07,51.94 12.38,51.75 R25.2
  Bottom 0.406: v4.19,51.94 4.19,49.59 5.72,48.07 5.72,45.85 v5.08,45.21
N$100
  Top 0.254: IC7.27 21.39,46.63 22.8,48.04 C16.1
N$101  (via drill 0.6)
  Top 0.305: Z2.1 v2.54,45.21 | P1.D- 4.98,52.74 4.51,53.21 v2.79,53.21
  Top 0.406: P1.D- 11.02,52.74 12.57,54.29 R23.2
  Bottom 0.406: v2.54,45.21 3.49,45.21 4.76,46.48 4.76,47.62 2.79,49.59 2.78,49.64 v2.79,53.21
N$103
  Top 0.203: IC7.30 19.89,51.87 17.46,54.29 R23.1
N$104  (via drill 0.6)
  Top 0.203: IC7.29 20.39,52.96 v19.53,53.82
  Top 0.406: R25.1 15.56,51.44 v17.15,51.44
  Bottom 0.406: v17.15,51.44 v19.53,53.82
N$105
  Top 0.305: R24.1 6.51,34.25 6.35,34.48 6.35,35.24 5.4,36.2 | LED6.C 4.13,37.47 5.4,36.2 | 5.4,36.2
N$109  (via drill 0.6)
  Top 0.254: IC7.13 20.89,39.94 v20.64,39.69
  Top 0.406: SJ1.1 v16.51,29.21 SJ3.2
  Bottom 0.406: v20.64,39.69 20.64,39.05 20.95,38.73 20.95,31.43 18.73,29.21 v16.51,29.21
N$110
  Top 0.254: IC7.11 19.89,40.21 16.19,36.51 13.81,36.51
  Top 0.305: 13.81,36.51 10.16,32.86 8.89,32.86 R22.2
N$111
  Top 0.254: IC7.10 19.39,40.66 15.88,37.15 13.33,37.15
  Top 0.305: 13.33,37.15 9.84,33.66 8.38,33.66 R24.2
N$116
  Top 0.305: LED5.C 4.16,31.88 4.6,31.43 R22.1
N$119  (via drill 0.6)
  Top 0.254: IC7.28 20.89,48.51 21.27,48.9 v21.27,50.16
  Top 0.406: L2.2 4.79,39.15 v5.87,38.07 | v3.11,33.02 2.73,32.58 2.73,31.24 2.7,31.21 SJ2.2
  Top 0.508: P1.GND 11.57,50.34 v11.75,50.16
  Bottom 0.305: v11.75,50.16 v21.27,50.16
  Bottom 0.406: v3.11,33.02 3.11,35.31 v5.87,38.07 5.87,41.43 5.87,41.75 11.75,47.62 v11.75,50.16
N$120  (via drill 0.5, 0.6)
  Top 0.305: 7.68,56.44 P1.SH3 | 3.67,42.4 3.62,42.29 3.75,42.42 | 3.75,47.37 3.67,47.44 P1.SH1 | 2.02,47.44 1.97,47.5 | v3.4,56.07 3.71,56.39 3.71,56.55 3.56,56.39 2.92,56.39 2.72,56.39 P1.SH2 2.36,56.86 v2.13,56.86
  Top 0.406: P1.SH2 7.68,56.44 | 3.75,42.42 3.75,47.37 | Z1.2 4.06,42.01 3.67,42.4 3.28,42.01 Z2.2 2.54,40.96 2.79,40.7 L2.1 | P1.SH1 P1.SH4 8.53,47.44 v8.87,47.1 8.16,47.82 v7.68,47.82 | P1.SH1 2.02,47.44 | 1.97,47.5 1.97,49.4 1.52,49.85 1.52,54.99 2.92,56.39 | 7.68,56.44 v7.68,56.86 | 7.68,56.44 | v8.95,56.07 8.65,56.07 P1.SH3 | P1.SH1 2.87,47.44 v2.17,47.78 | v3.36,47.1 3.12,47.1 P1.SH1
OC-OUT1  (via drill 0.6)
  Top 0.305: 38.42,22.22 32.7,16.51 28,16.51 J5.1 | 38.42,22.22 39.37,21.27 v46.67,21.27 | 38.42,22.22 IC8.18
  Top 0.406: v49.53,9.78 49.53,4.13 50.48,3.17 63.82,3.17 65.41,1.59 69.34,1.59 v69.53,1.78 69.72,1.59 78.36,1.59 79.06,2.28 79.06,2.92 R20.1 | R21.2 85.41,27.94 v84.14,26.67 | v73.34,14.35 v76.96,14.35
  Bottom 0.305: J3.12 28.26,50.8 28.26,22.22 29.53,20.95 34.61,20.95 IC8.18
  Bottom 0.406: v46.67,21.27 46.67,13.65 49.53,10.79 v49.53,9.78 | v84.14,26.67 84.14,25.65 81.6,23.11 81.6,21.97 76.96,17.34 v76.96,14.35 | v73.34,14.35 73.22,14.22 73.22,13.08 70.8,10.79 70.8,3.05 v69.53,1.78
OC-OUT2  (via drill 0.5, 0.6)
  Top 0.305: 26.99,8.26 26.99,10.79
  Top 0.406: v22.54,19.05 24.13,20.64 v27.94,20.64 | R27.2 72.52,25.08 v68.26,20.83 | v68.26,16.19 65.72,13.65 R26.1 | v22.54,16.51 22.54,15.24 24.45,13.34 26.99,13.34 | 26.99,13.34 28.38,13.34 29.27,14.22 J5.3 | 26.99,10.79 26.99,13.34 | v26.99,4.45 26.99,8.26
  Bottom 0.305: 27.62,52.71 27.62,21.91 27.94,21.59 v27.94,20.64 28.89,20.64 29.21,20.32 36.51,20.32 IC8.19
  Bottom 0.406: 27.62,52.71 J3.13 | v22.54,16.51 22.54,18.41 v22.54,19.05 | v68.26,20.83 v68.26,16.19 68.26,5.08 65.09,1.91 33.34,1.91 30.8,4.45 v26.99,4.45
RED_PWM
  Top 0.406: R12.2 42.23,57.15 J3.9
  Bottom 0.406: J3.9 32.07,46.99 32.07,31.11 30.8,29.84 IC8.15
RESET  (via drill 0.6)
  Top 0.406: v65.72,23.49 65.72,26.67 63.82,28.57 IC8.1 | R17.1 | R17.1 C11.2 | R17.1 10.48,22.86 11.11,22.22 v11.11,20.89 | v17.72,4.57 17.72,5.71 18.22,6.22 S3.1
  Bottom 0.305: 14.29,8.89 14.29,10.79 | 30.54,16.51
  Bottom 0.406: 17.08,6.99 32.07,6.99 J3.RESET 35.88,3.17 64.45,3.17 65.72,4.45 v65.72,23.49 | 14.29,8.89 16.19,6.99 17.08,6.99 | J5.5 30.54,16.51 23.97,16.51 22.07,14.61 20.95,14.61 14.67,20.89 v11.11,20.89 14.29,17.72 14.29,10.79 | 17.08,6.99 17.72,6.35 v17.72,4.57
RXD  (via drill 0.6)
  Top 0.254: 18.89,41.43 v17.46,40.01
  Top 0.305: IC7.9 18.89,41.43 | J3.0_RX 63.82,55.88 63.18,56.52 45.09,56.52 v43.81,55.25 | v25.48,43.82 v33.97,43.82
  Bottom 0.406: J3.0_RX 63.82,48.9 64.87,47.84 | v17.46,40.01 21.27,43.82 v25.48,43.82 | v33.97,43.82 43.81,53.34 v43.81,55.25 | 64.87,47.84 61.28,44.26 IC8.2 | 64.87,47.84 69.99,47.84 70.25,48.1 72.17,48.1 IC3.2
TEMP  (via drill 0.6)
  Top 0.406: J3.A_0 v51.12,13.34 48.32,10.54 48.32,3.68 51.37,0.64 84.39,0.64 85.41,1.65 IC6.2
  Bottom 0.406: v51.12,13.34 IC8.23
TOUCH1
  Top 0.254: J4.X1 70.28,9.09 69.22,10.16
  Top 0.305: 69.22,10.16 58.74,10.16 56.2,7.62 J3.A_2
  Bottom 0.406: J3.A_2 IC8.25
TOUCH2
  Top 0.254: J4.Y2 69.78,8.64 68.9,9.53
  Top 0.305: 68.9,9.53 60.64,9.53 58.74,7.62 J3.A_3
  Bottom 0.406: J3.A_3 IC8.26
TOUCH3
  Top 0.254: J4.X2 69.28,8.19 68.58,8.89
  Top 0.305: 68.58,8.89 62.55,8.89 61.28,7.62 J3.A_4
  Bottom 0.406: J3.A_4 IC8.27
TOUCH4
  Top 0.254: J4.Y1 68.78,7.73 68.26,8.26
  Top 0.305: 68.26,8.26 64.45,8.26 63.82,7.62 J3.A_5
  Bottom 0.406: J3.A_5 IC8.28
TXD  (via drill 0.6)
  Top 0.254: v12.07,38.1 14.29,38.1 18.25,42.07
  Top 0.305: 18.25,42.07 IC7.8 | v20.64,56.2 29.84,56.2 33.66,60.01 40.01,60.01 40.64,60.64 41.91,60.64 42.39,60.17 v72.87,60.17
  Top 0.406: v82.39,55.25 R1.1 | R1.1
  Bottom 0.305: v12.07,38.1 11.11,39.05 11.11,45.72 14.92,49.53 20.32,49.53 20.64,49.21 21.75,49.21 22.22,49.69 22.22,51.44 20.64,53.02 v20.64,56.2
  Bottom 0.406: v72.87,60.17 72.87,58.9 76.52,55.25 | 76.52,55.25 v82.39,55.25 | 76.52,55.25 74.3,53.02 68.26,53.02 65.09,56.2 63.5,56.2 J3.1_TX 58.74,51.44 IC8.3
USBVCC  (via drill 0.6)
  Top 0.203: IC7.31 19.39,50.78 v17.15,53.02
  Top 0.508: F1.2 20,57.79 20.64,58.42 JP1.1
  Bottom 0.406: v17.15,53.02 17.15,54.93 20.64,58.42 JP1.1
VR1
  Top 0.406: J1.3 7.94,15.05 VR1.S

### Text on the board
tPlace: OFF | ON | + | Arduino-compatible | + | Development board and | v2.0 | Pebble | wireless sensor node | Luke Weston, 2011 | POWER | RSSI | + | Open Hardware under the | freetronics | ASSOC | XBee | CERN Open Hardware License: | - | 5V | www.ohwr.org/cernohl | MAX | 1 | 2.4-5V | OC | 2 | USBVCC | AREF | GND | D13 | D12 | D11 | D10 | D9 | D8 | D7 | D6 | D5 | D4 | D3 | D2 | D1 | D0 | 1 | 20 | RX | + | USB | 14 | 1 | TX | 10 | 11 | <-OPEN COLLECTOR OUTPUTS | 15 | 28 | + | 1 | OC | Encoder | + | 2 | OC | 5V | + | Light | RST | 5V | GND | A0 | A1 | A2 | A3 | A4 | A5 | 3V3 | GND | NC | Reset | Touch | Temp
bPlace: + | -
Document: + | + | + | RGB LED | R | B | (Com. Cathode) | + | CC | G | OC2 | OC1 | Blue | Grn | Red | Butn | B | A | BL | Clk | Data | Str | TxD | RxD | OUTPUTS | RGB LED | ENCODER | LCD | USB | 1 | UGND | AutoReset | Boot | E | B | C | LCD Contrast | Encoder | 1 | GND | VDD | Vo | RS | RW | E | D4 | D5 | D6 | D7 | A | K | E | B | Touch | 1 | C | Temp | Light | 1 | 2 | 3 | 4 | Reset
tDocu: EAGLE LAYERS FOR TOP SILKSCREEN GERBER LAYER: | 21 TPlace | 27 TValues | 48 Document | Fix the Encoder mount pads | to through-hole plated slots